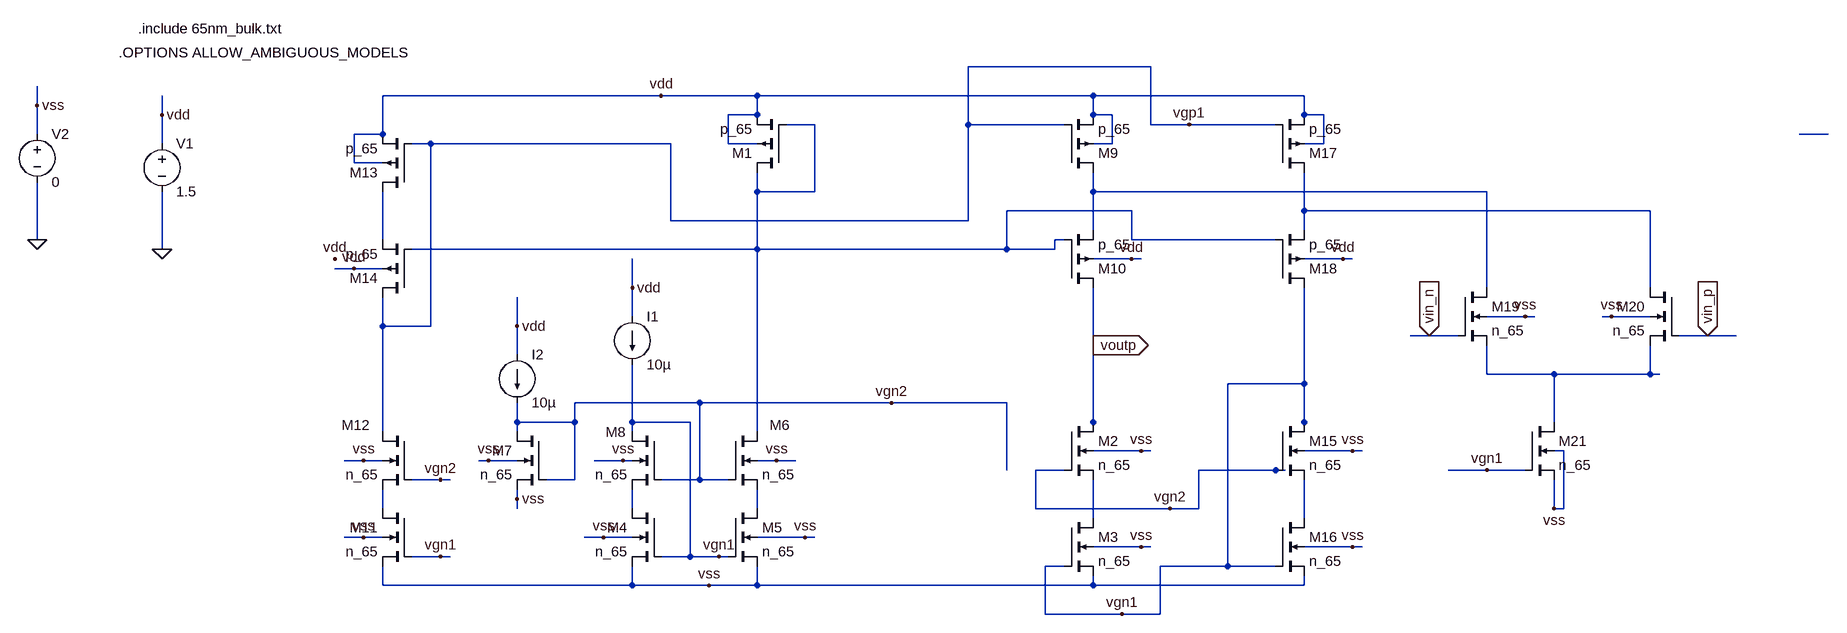
[diagram p0: schematic FC_SingleEnded.asc]
FC_SingleEnded.asc, the LTspice schematic file:
Version 4.1
SHEET 1 2276 908
WIRE 560 -48 256 -48
WIRE -256 0 -720 0
WIRE -96 0 -256 0
WIRE 464 0 -96 0
WIRE 816 0 464 0
WIRE -1296 16 -1296 -16
WIRE -1088 32 -1088 0
WIRE -96 32 -96 0
WIRE -96 32 -144 32
WIRE 464 32 464 0
WIRE 496 32 464 32
WIRE 816 32 816 0
WIRE 848 32 816 32
WIRE 0 48 -48 48
WIRE 256 48 256 -48
WIRE 416 48 256 48
WIRE 560 48 560 -48
WIRE 624 48 560 48
WIRE 768 48 624 48
WIRE -1296 64 -1296 16
WIRE -720 64 -720 0
WIRE -720 64 -768 64
WIRE 2272 64 2224 64
WIRE -1088 80 -1088 32
WIRE -720 80 -720 64
WIRE -640 80 -672 80
WIRE -240 80 -640 80
WIRE -144 80 -144 32
WIRE -96 80 -144 80
WIRE 496 80 496 32
WIRE 496 80 464 80
WIRE 848 80 848 32
WIRE 848 80 816 80
WIRE -768 112 -768 64
WIRE -720 112 -768 112
WIRE -96 160 -96 128
WIRE 0 160 0 48
WIRE 0 160 -96 160
WIRE 464 160 464 128
WIRE 1120 160 464 160
WIRE 528 192 320 192
WIRE 816 192 816 128
WIRE 1392 192 816 192
WIRE -240 208 -240 80
WIRE 256 208 256 48
WIRE 256 208 -240 208
WIRE 464 224 464 160
WIRE 816 224 816 192
WIRE -1296 240 -1296 144
WIRE -720 240 -720 160
WIRE 416 240 400 240
WIRE 528 240 528 192
WIRE 768 240 528 240
WIRE -1088 256 -1088 160
WIRE -96 256 -96 160
WIRE -96 256 -672 256
WIRE 320 256 320 192
WIRE 320 256 -96 256
WIRE 400 256 400 240
WIRE 400 256 320 256
WIRE 528 272 464 272
WIRE 544 272 528 272
WIRE 880 272 816 272
WIRE 896 272 880 272
WIRE -768 288 -800 288
WIRE -720 288 -768 288
WIRE -304 320 -304 272
WIRE 1120 320 1120 160
WIRE 1392 320 1392 192
WIRE -304 368 -304 320
WIRE 1184 368 1120 368
WIRE 1200 368 1184 368
WIRE 1328 368 1312 368
WIRE 1392 368 1328 368
WIRE -720 384 -720 336
WIRE -640 384 -640 80
WIRE -640 384 -720 384
WIRE -496 384 -496 336
WIRE 1024 400 992 400
WIRE 1072 400 1024 400
WIRE 1488 400 1440 400
WIRE 1536 400 1488 400
WIRE 464 416 464 320
WIRE -496 432 -496 384
WIRE 1120 464 1120 416
WIRE 1232 464 1120 464
WIRE 1392 464 1392 416
WIRE 1392 464 1232 464
WIRE 1408 464 1392 464
WIRE 816 480 816 320
WIRE 816 480 688 480
WIRE -192 512 -400 512
WIRE 128 512 -192 512
WIRE 320 512 128 512
WIRE -496 544 -496 512
WIRE -400 544 -400 512
WIRE -400 544 -496 544
WIRE -304 544 -304 448
WIRE -208 544 -304 544
WIRE 464 544 464 416
WIRE 816 544 816 480
WIRE 1232 544 1232 464
WIRE -720 560 -720 384
WIRE -496 560 -496 544
WIRE -304 560 -304 544
WIRE -96 560 -96 256
WIRE 464 560 464 544
WIRE 816 560 816 544
WIRE 544 592 464 592
WIRE 560 592 544 592
WIRE 896 592 816 592
WIRE 912 592 896 592
WIRE 1248 592 1232 592
WIRE -752 608 -784 608
WIRE -720 608 -752 608
WIRE -544 608 -560 608
WIRE -496 608 -544 608
WIRE -320 608 -368 608
WIRE -304 608 -320 608
WIRE -64 608 -96 608
WIRE -32 608 -64 608
WIRE 320 624 320 512
WIRE 416 624 368 624
WIRE 768 624 640 624
WIRE 784 624 768 624
WIRE 1120 624 1056 624
WIRE 1184 624 1120 624
WIRE -624 640 -672 640
WIRE -608 640 -624 640
WIRE -400 640 -400 544
WIRE -400 640 -448 640
WIRE -192 640 -192 512
WIRE -192 640 -256 640
WIRE -144 640 -192 640
WIRE -496 672 -496 656
WIRE -720 688 -720 656
WIRE -496 688 -496 672
WIRE -304 688 -304 656
WIRE -96 688 -96 656
WIRE 368 688 368 624
WIRE 592 688 368 688
WIRE 640 688 640 624
WIRE 640 688 592 688
WIRE 1232 688 1232 640
WIRE 1248 688 1248 592
WIRE 1248 688 1232 688
WIRE 464 704 464 640
WIRE 816 704 816 640
WIRE -752 736 -784 736
WIRE -720 736 -752 736
WIRE -352 736 -384 736
WIRE -304 736 -352 736
WIRE -16 736 -96 736
WIRE 0 736 -16 736
WIRE 544 752 464 752
WIRE 560 752 544 752
WIRE 896 752 816 752
WIRE 912 752 896 752
WIRE -624 768 -672 768
WIRE -608 768 -624 768
WIRE -208 768 -208 544
WIRE -208 768 -256 768
WIRE -160 768 -208 768
WIRE -144 768 -160 768
WIRE 416 784 384 784
WIRE 688 784 688 480
WIRE 688 784 576 784
WIRE 768 784 688 784
WIRE -720 816 -720 784
WIRE -304 816 -304 784
WIRE -304 816 -720 816
WIRE -176 816 -304 816
WIRE -96 816 -96 784
WIRE -96 816 -176 816
WIRE 464 816 464 800
WIRE 464 816 -96 816
WIRE 816 816 816 800
WIRE 816 816 464 816
WIRE 384 864 384 784
WIRE 512 864 384 864
WIRE 576 864 576 784
WIRE 576 864 512 864
FLAG -304 320 vdd
FLAG 544 592 vss
FLAG 544 752 vss
FLAG -64 608 vss
FLAG -176 816 vss
FLAG -496 384 vdd
FLAG -496 672 vss
FLAG -320 608 vss
FLAG 528 272 vdd
FLAG -752 608 vss
FLAG -624 768 vgn1
FLAG -624 640 vgn2
FLAG -256 0 vdd
FLAG -1088 256 0
FLAG -1088 32 vdd
FLAG -1296 240 0
FLAG -1296 16 vss
FLAG 464 416 voutp
IOPIN 464 416 Out
FLAG 896 592 vss
FLAG 896 752 vss
FLAG 880 272 vdd
FLAG 1184 368 vss
FLAG 1328 368 vss
FLAG 1232 688 vss
FLAG 1488 400 vin_p
IOPIN 1488 400 In
FLAG 1024 400 vin_n
IOPIN 1024 400 In
FLAG 624 48 vgp1
FLAG 128 512 vgn2
FLAG 512 864 vgn1
FLAG 592 688 vgn2
FLAG -160 768 vgn1
FLAG -800 272 vdd
FLAG -768 288 vdd
FLAG -16 736 vss
FLAG -352 736 vss
FLAG -544 608 vss
FLAG -752 736 vss
FLAG 1120 624 vgn1
DATAFLAG 240 512 ""
DATAFLAG 320 256 ""
DATAFLAG 576 32 ""
DATAFLAG 816 16 ""
DATAFLAG 464 368 ""
DATAFLAG 816 368 ""
DATAFLAG 1232 192 ""
DATAFLAG 544 160 ""
DATAFLAG 816 688 ""
DATAFLAG 464 688 ""
DATAFLAG 1232 672 ""
DATAFLAG 432 784 ""
DATAFLAG 672 240 ""
DATAFLAG 656 768 ""
DATAFLAG -656 640 ""
DATAFLAG -656 768 ""
DATAFLAG -240 640 ""
DATAFLAG -240 768 ""
DATAFLAG -352 80 ""
DATAFLAG -400 256 ""
DATAFLAG -720 176 ""
DATAFLAG 1120 208 ""
DATAFLAG 1232 512 ""
DATAFLAG 1104 608 ""
DATAFLAG 816 368 ""
DATAFLAG 464 480 ""
DATAFLAG 1472 400 ""
DATAFLAG 1056 400 ""
SYMBOL pmos4 -48 128 R180
SYMATTR InstName M1
SYMATTR Value p_65
SYMATTR Value2 l=200n w=2.5u
SYMBOL nmos4 416 544 R0
SYMATTR InstName M2
SYMATTR Value n_65
SYMATTR Value2 l=200n w=10u
SYMBOL nmos4 416 704 R0
SYMATTR InstName M3
SYMATTR Value n_65
SYMATTR Value2 l=200n w=10u
SYMBOL nmos4 -256 688 M0
SYMATTR InstName M4
SYMATTR Value n_65
SYMATTR Value2 l=200n w=10u
SYMBOL current -304 368 R0
WINDOW 123 0 0 Left 0
WINDOW 39 0 0 Left 0
SYMATTR InstName I1
SYMATTR Value 10µ
SYMBOL nmos4 -144 688 R0
SYMATTR InstName M5
SYMATTR Value n_65
SYMATTR Value2 l=200n w=10u
SYMBOL nmos4 -144 560 R0
WINDOW 0 69 -11 Left 2
SYMATTR InstName M6
SYMATTR Value n_65
SYMATTR Value2 l=200n w=10u
SYMBOL nmos4 -448 560 M0
SYMATTR InstName M7
SYMATTR Value n_65
SYMATTR Value2 l=200n w=2.5u
SYMBOL current -496 432 R0
WINDOW 123 0 0 Left 0
WINDOW 39 0 0 Left 0
SYMATTR InstName I2
SYMATTR Value 10µ
SYMBOL nmos4 -256 560 M0
WINDOW 0 59 1 Left 2
SYMATTR InstName M8
SYMATTR Value n_65
SYMATTR Value2 l=200n w=10u
SYMBOL pmos4 416 128 M180
SYMATTR InstName M9
SYMATTR Value p_65
SYMATTR Value2 l=200n w=20u
SYMBOL pmos4 416 320 M180
SYMATTR InstName M10
SYMATTR Value p_65
SYMATTR Value2 l=200n w=10u
SYMBOL nmos4 -672 688 M0
SYMATTR InstName M11
SYMATTR Value n_65
SYMATTR Value2 l=200n w=10u
SYMBOL nmos4 -672 560 M0
WINDOW 0 69 -11 Left 2
SYMATTR InstName M12
SYMATTR Value n_65
SYMATTR Value2 l=200n w=10u
SYMBOL pmos4 -672 160 R180
SYMATTR InstName M13
SYMATTR Value p_65
SYMATTR Value2 l=200n w=10u
SYMBOL pmos4 -672 336 R180
SYMATTR InstName M14
SYMATTR Value p_65
SYMATTR Value2 l=200n w=10u
SYMBOL voltage -1088 64 R0
WINDOW 123 0 0 Left 0
WINDOW 39 0 0 Left 0
SYMATTR InstName V1
SYMATTR Value 1.5
SYMBOL voltage -1296 48 R0
WINDOW 123 0 0 Left 0
WINDOW 39 0 0 Left 0
SYMATTR InstName V2
SYMATTR Value 0
SYMBOL nmos4 768 544 R0
SYMATTR InstName M15
SYMATTR Value n_65
SYMATTR Value2 l=200n w=10u
SYMBOL nmos4 768 704 R0
SYMATTR InstName M16
SYMATTR Value n_65
SYMATTR Value2 l=200n w=10u
SYMBOL pmos4 768 128 M180
SYMATTR InstName M17
SYMATTR Value p_65
SYMATTR Value2 l=200n w=20u
SYMBOL pmos4 768 320 M180
SYMATTR InstName M18
SYMATTR Value p_65
SYMATTR Value2 l=200n w=10u
SYMBOL nmos4 1072 320 R0
SYMATTR InstName M19
SYMATTR Value n_65
SYMATTR Value2 l=200n w=80u
SYMBOL nmos4 1440 320 M0
SYMATTR InstName M20
SYMATTR Value n_65
SYMATTR Value2 l=200n w=80u
SYMBOL nmos4 1184 544 R0
SYMATTR InstName M21
SYMATTR Value n_65
SYMATTR Value2 l=200n w=20u
TEXT -1128 -112 Left 2 !.include 65nm_bulk.txt
TEXT -1160 -72 Left 2 !.OPTIONS ALLOW_AMBIGUOUS_MODELS

The netlist it stands for:
* FC_SingleEnded.asc
M1 N001 N001 vdd vdd p_65 l=200n w=2.5u
M2 voutp vgn2 N010 vss n_65 l=200n w=10u
M3 N010 vgn1 vss vss n_65 l=200n w=10u
M4 N008 vgn1 vss vss n_65 l=200n w=10u
I1 vdd vgn1 10µ
M5 N009 vgn1 vss vss n_65 l=200n w=10u
M6 N001 vgn2 N009 vss n_65 l=200n w=10u
M7 vgn2 vgn2 vss vss n_65 l=200n w=2.5u
I2 vdd vgn2 10µ
M8 vgn1 vgn2 N008 vss n_65 l=200n w=10u
M9 N003 vgp1 vdd vdd p_65 l=200n w=20u
M10 voutp N001 N003 vdd p_65 l=200n w=10u
M11 N007 vgn1 vss vss n_65 l=200n w=10u
M12 vgp1 vgn2 N007 vss n_65 l=200n w=10u
M13 N005 vgp1 vdd vdd p_65 l=200n w=10u
M14 vgp1 N001 N005 vdd p_65 l=200n w=10u
V1 vdd 0 1.5
V2 vss 0 0
M15 vgn1 vgn2 N011 vss n_65 l=200n w=10u
M16 N011 vgn1 vss vss n_65 l=200n w=10u
M17 N004 vgp1 vdd vdd p_65 l=200n w=20u
M18 vgn1 N001 N004 vdd p_65 l=200n w=10u
M19 N003 vin_n N006 vss n_65 l=200n w=80u
M20 N004 vin_p N006 vss n_65 l=200n w=80u
M21 N006 vgn1 vss vss n_65 l=200n w=20u
.model NMOS NMOS
.model PMOS PMOS
.lib standard.mos
.include 65nm_bulk.txt
.OPTIONS ALLOW_AMBIGUOUS_MODELS
.backanno
.end